# Altium schematic sheet Sheet2.SchDoc
size A3; SheetNumber: 2; SheetTotal: 3
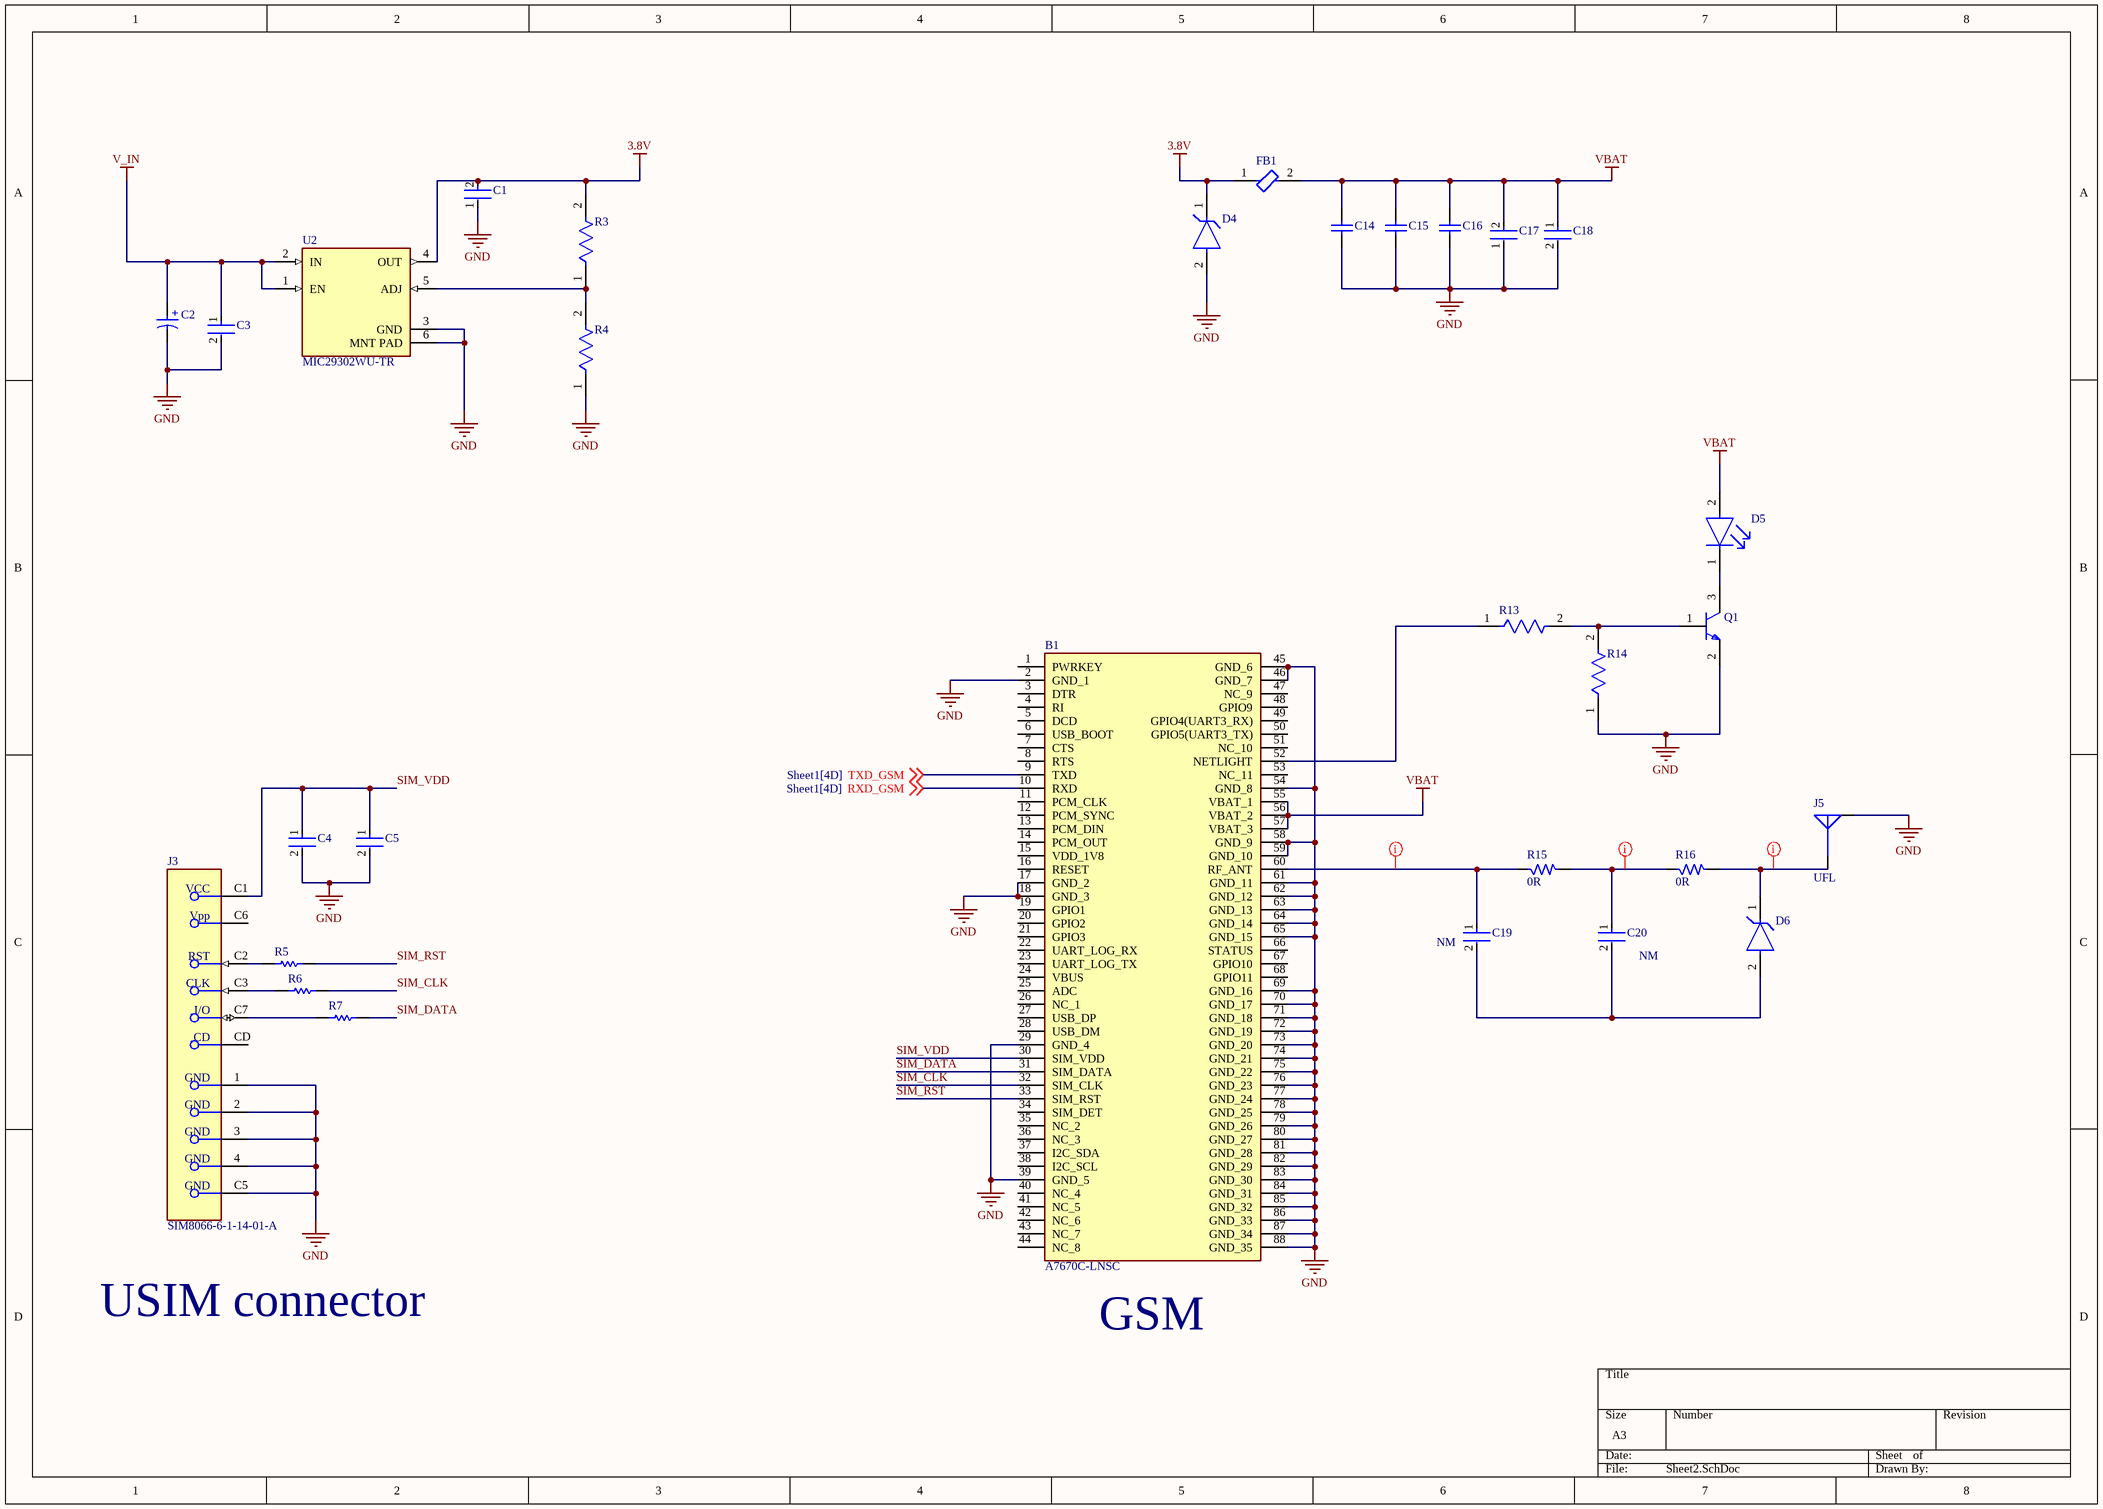
[diagram p0: Sheet2.SchDoc]

## Parts
B1  A7670C-LNSC  [A7670CLNSC]
C1  GRM155R71C104KA88D  [FP-GRM15-MFG]  (value not drawn)
C2  865060653010  [WCAP-ASLL_D8H10.5]  (value not drawn)
C3  C0402C105K8PACTU  [FP-C0402C105K8PACTU-MFG]  (value not drawn)
C4  C0402C104K4RACTU  [FP-C0402-BB-MFG]  (value not drawn)
C5  04025A330JAT2A  [FP-0402-L_1_0_1-W_0_5_0_1-IPC_A]  (value not drawn)
C14  GRM31CR60J107ME39L  [CAPC3216X190X55ML30T25]  (value not drawn)
C15  GRM31CR60J107ME39L  [CAPC3216X190X55ML30T25]  (value not drawn)
C16  GRM21BR71H105KA12L  [CAPC2013X135X45LL10T25]  (value not drawn)
C17  GRM155R71C104KA88D  [FP-GRM15-MFG]  (value not drawn)
C18  CC0603JRNPO9BN330  [FP-CC0603-0_9-IPC_C]  (value not drawn)
C19  04025C222KAT2A  [FP-0402-L_1_0_1-W_0_5_0_1-MFG]  (value not drawn)
C20  C0402C104K4RACTU  [FP-C0402-BB-MFG]  (value not drawn)
D4  SMAJ6.0A  [FP-SMAJ-MFG]  (value not drawn)
D5  LTST-C190GKT  [FP-LTST-C190GKT-MFG]  (value not drawn)
D6  SMAJ6.0A  [FP-SMAJ-MFG]  (value not drawn)
FB1  BLM21PG300SN1D  [FP-BLM21-0_2-t0_85-e0_5-d-MFG]  (value not drawn)
J3  SIM8066-6-1-14-01-A  [FP-SIM8066-6-1-14-01-A-MFG]
J5  UFL  [MOLEX SD-734120110]
Q1  BC846B,215  [FP-SOT23-IPC_B]  (value not drawn)
R3  CRCW0402100KFKED  [FP-CRCW0402-e3-IPC_C]  (value not drawn)
R4  CRCW060347K0FKEA  [FP-CRCW0603-e3-IPC_B]  (value not drawn)
R5  CRCW040222R0FKED  [RESC1005X40X25LL05T05]  (value not drawn)
R6  CRCW040222R0FKED  [RESC1005X40X25LL05T05]  (value not drawn)
R7  CRCW040222R0FKED  [RESC1005X40X25LL05T05]  (value not drawn)
R13  CRCW06034K70FKEA  [FP-CRCW0603-e3-IPC_A]  (value not drawn)
R14  CRCW060347K0FKEA  [FP-CRCW0603-e3-IPC_B]  (value not drawn)
R15  0R  [RES_0805]
R16  0R  [RES_0805]
U2  MIC29302WU-TR  [FP-C04-012-MFG]

## Nets
3.8V: C1.2 D4.1(C) FB1.1 R3.2 U2.4(OUT)
GND: B1.2(GND_1) B1.17(GND_2) B1.18(GND_3) B1.29(GND_4) B1.39(GND_5) B1.45(GND_6) B1.46(GND_7) B1.54(GND_8) B1.58(GND_9) B1.59(GND_10) B1.61(GND_11) B1.62(GND_12) B1.63(GND_13) B1.64(GND_14) B1.65(GND_15) B1.69(GND_16) B1.70(GND_17) B1.71(GND_18) B1.72(GND_19) B1.73(GND_20) B1.74(GND_21) B1.75(GND_22) B1.76(GND_23) B1.77(GND_24) B1.78(GND_25) B1.79(GND_26) B1.80(GND_27) B1.81(GND_28) B1.82(GND_29) B1.83(GND_30) B1.84(GND_31) B1.85(GND_32) B1.86(GND_33) B1.87(GND_34) B1.88(GND_35) C1.1 C2.2(N) C3.2 C4.2 C5.2 C14.1 C15.1 C16.1 C17.1 C18.2 D4.2(A) J3.1(GND) J3.2(GND) J3.3(GND) J3.4(GND) J3.C5(GND) J5.G Q1.2(E) R4.1 R14.1 U2.3(GND) U2.6(MNT_PAD)
V_IN: C2.1(P) C3.1 U2.1(EN) U2.2(IN)
VBAT: B1.55(VBAT_1) B1.56(VBAT_2) B1.57(VBAT_3) C14.2 C15.2 C16.2 C17.2 C18.1 D5.2(A) FB1.2
RXD_GSM: B1.10(RXD) ; off-sheet RXD_GSM
SIM_CLK: B1.32(SIM_CLK) R6.2
SIM_DATA: B1.31(SIM_DATA) R7.2
SIM_RST: B1.33(SIM_RST) R5.2
SIM_VDD: B1.30(SIM_VDD) C4.1 C5.1 J3.C1(VCC)
TXD_GSM: B1.9(TXD) ; off-sheet TXD_GSM
NetB1_52: B1.52(NETLIGHT) R13.1
NetB1_60: B1.60(RF_ANT) C19.1 R15.1
NetC19_2: C19.2 C20.2 D6.2(A)
NetC20_1: C20.1 R15.2 R16.1
NetD5_1: D5.1(C) Q1.3(C)
NetD6_1: D6.1(C) J5.S R16.2
NetJ3_C2: J3.C2(RST) R5.1
NetJ3_C3: J3.C3(CLK) R6.1
NetJ3_C7: J3.C7(I/O) R7.1
NetQ1_1: Q1.1(B) R13.2 R14.2
NetR3_1: R3.1 R4.2 U2.5(ADJ)

Not connected (* = marked no-connect by the designer): B1 1(PWRKEY) 3(DTR) 4(RI) 5(DCD) 6(USB_BOOT) 7(CTS) 8(RTS) 11(PCM_CLK) 12(PCM_SYNC) 13(PCM_DIN) 14(PCM_OUT) 15(VDD_1V8) 16(RESET) 19(GPIO1) 20(GPIO2) 21(GPIO3) 22(UART_LOG_RX) 23(UART_LOG_TX) 24(VBUS) 25(ADC) 26(NC_1) 27(USB_DP) 28(USB_DM) 34(SIM_DET) 35(NC_2) 36(NC_3) 37(I2C_SDA) 38(I2C_SCL) 40(NC_4) 41(NC_5) 42(NC_6) 43(NC_7) 44(NC_8) 47(NC_9) 48(GPIO9) 49(GPIO4(UART3_RX)) 50(GPIO5(UART3_TX)) 51(NC_10) 53(NC_11) 66(STATUS) 67(GPIO10) 68(GPIO11); J3 C6(Vpp) CD

## Layout directives
net class 50ohm_gsm; rule Width Constraint [Pref Impedance = 50.00ohms    Min Impedance = 50.00ohms    Max Impedance = 50.00ohms]: NetB1_60, NetC20_1, NetD6_1

## Notes on the sheet
- (near C19) NM
- (near C20) NM
- USIM connector
- (near B1) GSM
- (in symbol CMP-03913-54202488-2) +

## Library data of the parts
B1 = A7670C-LNSC: MODULE LTE CAT1; Manufacturer_Name: SIMCOM; Geometry.Height: 2.77mm; Manufacturer_Part_Number: A7670C-LNSC; Mouser Part Number: *; Mouser Price/Stock: *; Arrow Part Number: *; Arrow Price/Stock: *; Datasheet Link: https://nostris.ee/pdf/A7670%20Series%20Hardware%20Design_V1.00.pdf
C1 C17 = CMP-2100-03641-2: CAP CER 0.1UF 16V X7R 0402; Manufacturer: Murata; Standoff Height: 0mm; Tolerance: 10%; Voltage Rating: 16Vdc; Material: Ceramic; Capacitance: 0.10μF; Value: 0.10μF; RoHS: TRUE; Manufacturer Part Number: GRM155R71C104KA88D; Temperature Characteristic: X7R; Octopart: https://octopart.com/grm155r71c104ka88d-murata-196880; Digikey Description: CAP CER 0.1UF 16V X7R 0402; Device Class L3: Ceramic Capacitors; Height: 0.55mm; ComponentLink2Description: Datasheet; Temperature Range Low: -55°C; Ipc Land Pattern Name: CAPC10050X219; ComponentLink2URL: https://search.murata.co.jp/Ceramy/image/img/A01X/G101/ENG/GRM155R71H471KA01-01A.pdf; Device Class L1: Passive Components; Lead Free: yes; Category: Cap; Package: GRM15; Temperature: -55°C to +125°C; Device Class L2: Capacitors; Temperature Range High: +125°C; Mouser Description: 0402 0.1 uF 16V ±10 % Tolerance X7R SMT Multilayer Ceramic Capacitor
C2 = CMP-03913-54202488-2: 865060653010 Aluminum Electrolytic Capacitor, Polarized, Aluminum (wet), 50V, 20% +Tol, 20% -Tol, 100uF, Surface Mount, 3333; Ripple Current (AC): 350mA; ESR (Equivalent Series Resistance): 227.529mΩ; Polarity: Polar; Leakage Current: 50µA; Life (Hours): 5000hours; Capacitance: 100µF; Impedance: 340mΩ; Insulation Resistance: 1MΩ; Voltage Rating (DC): 50V; NexarPartId: 54202488; Min Operating Temperature: -55°C; Case/Package: Radial; Height - Seated (Max): 10.4902mm; Ripple Current: 350mA; Diameter: 8mm; Height: 10.5mm; Voltage Rating: 50V; Max Operating Temperature: 105°C; REACH SVHC: Unknown; Tolerance: 20%; Mount: Surface Mount; RoHS: Compliant; Length: 10.5mm
C3 = CMP-2008-02081-2: CAP CER 1UF 10V X5R 0402; Dielectric Material: Ceramic; Dissipation Factor: 5%; Tolerance: 10%; Number of Pins: 2; Contact Plating: Tin; Min Operating Temperature: -55°C; Termination: SMD/SMT; Lead Free: Lead Free; Construction: Flat; Voltage Rating (DC): 10V; Mount: Surface Mount; Series: C; Thickness: 0.022inch; Width: 0.5mm; Radiation Hardening: No; Capacitance: 1uF; Dielectric: X5R; Height: 0.5mm; Voltage: 10V; Length: 1mm; Depth: 0.5mm; Max Operating Temperature: 85°C; Package Quantity: 1; Packaging: Tape and Reel; RoHS Compliant: Yes; Case Code (Imperial): 0402; Case Code (Metric): 1005; REACH SVHC: No SVHC; Voltage Rating: 10V; Case/Package: 0402
C4 C20 = CMP-2008-02108-2: CAP CER 0.1UF 16V X7R 0402; Manufacturer: Kemet; Value: 0.10 μF; Tolerance: 0.1; Material: Ceramic; Temperature Coefficient: 15%; Voltage Rating: 16 V; Package: C0402-BB; Automotive: No; Ipc Land Pattern Name: CAPC10050X50; Device Class L3: Ceramic Capacitors; Capacitance: 0.10 μF; Octopart: https://octopart.com/c0402c104k4ractu-kemet-94158; Temperature Characteristic: X7R; Mouser Description: Cap Ceramic 0.1uF 16V X7R 10% SMD 0402 125?C Paper T/R - Tape and Reel (Alt: C0402C104K4RAC TU); ComponentLink2Description: Datasheet; Temperature Range Low: -55°C; RoHS: TRUE; Device Class L1: Passive Components; Manufacturer Part Number: C0402C104K4RACTU; Temperature Range High: +125°C; Device Class L2: Capacitors; ComponentLink2URL: https://content.kemet.com/datasheets/KEM_C1002_X7R_SMD.pdf; Category: Cap; Height: 0.55mm; Temperature: -55°C to +125°C; Lead Free: Yes; Digikey Description: CAP CER 0.1UF 16V X7R 0402
C5 = CMP-2008-02637-2: General Purpose Ceramic Capacitor, 0402, 33pF, 5%, C0G, 30ppm/°C, 50V; Insulation Resistance: 100GR; REACH SVHC: No SVHC; Radiation Hardening: No; Voltage Rating (DC): 50V; Tolerance: 5%; Voltage Rating: 50V; Mount: Surface Mount; Packaging: Tape and Reel; Construction: Flat; Voltage: 50V; Case/Package: 0402; Temperature Coefficient: 30ppm/°C; Lead Free: Lead Free; Case Code (Metric): 1005; Number of Pins: 2; Min Operating Temperature: -55°C; Capacitance: 33pF; Width: 0.5mm; Dielectric: C0G; Height: 0.5mm; Thickness: 0.022inch; Contact Plating: Tin; Length: 1mm; Package Quantity: 1; Depth: 0.5mm; Termination: SMD/SMT; Max Operating Temperature: 125°C; RoHS Compliant: Yes; Case Code (Imperial): 0402; Series: -
C14 C15 = CMP-1662-00011-2: Chip Capacitor, 100 uF, +/- 20%, 6.3 V, -55 to 85 degC, 1206 (3216 Metric), RoHS, Tape and Reel; Case\/Package: 1206; Capacitance: 100 uF; Voltage Rating (DC): 6.3 V; Type (Capacitors): X5R; REACH SVHC: No SVHC; Height: 1.6 mm; Tolerance: 20%; Packaging: Tape and Reel; Mount: Surface Mount; PackageDescription: 2-Pin Surface Mount Device, Body 3.2 x 1.6 mm; ComponentLink1URL: http://www.murata.com/; Pins: 2; ComponentLink2Description: Datasheet; PackageReference: 1206; Width: 1.6 mm; Package Quantity: 2000; Min Operating Temperature: -55 degC; Case Code (Imperial): 1206; Max Operating Temperature: 85 degC; DatasheetVersion: 09/2016; Mounting Technology: Surface Mount; Voltage Rating: 6.3 V; ComponentLink1Description: Manufacturer URL; Radiation Hardening: No; Case Code (Metric): 3216; PartNumber: GRM31CR60J107ME39L; Length: 3.2 mm; ComponentLink2URL: http://psearch.en.murata.com/capacitor/product/GRM31CR60J107ME39%23.pdf; RoHSCompliant: true
C16 = CMP-1036-04761-2: Manufacturer: Murata; Part Number: GRM21BR71H105KA12L
C18 = CMP-2000-06072-2: CAP CER 33PF 50V C0G/NPO 0603; Tolerance: 5%; Temperature Coefficient: 30ppm/°C; Dielectric: C0G; Insulation Resistance: 100GR; Dielectric Material: Ceramic; Voltage Rating (DC): 50V; Capacitance: 33pF; Voltage: 50V; Resistor Type: Ceramic; Lead Free: Lead Free; Mount: Surface Mount; Case Code (Imperial): 0603; Min Operating Temperature: -55°C; Package Quantity: 1; Case Code (Metric): 1608; Radiation Hardening: No; Packaging: Tape and Reel; Length: 1.6mm; Width: 0.031inch; Termination: SMD/SMT; Max Operating Temperature: 125°C; Series: CC; Case/Package: 0603; RoHS Compliant: Yes; Number of Pins: 2; REACH SVHC: No SVHC; Thickness: 0.035inch; Depth: 0.8mm; Voltage Rating: 50V; Height: 0.8mm
C19 = CMP-2008-02711-2: General Purpose Ceramic Capacitor, 0402, 2.2nF, 10%, X7R, 15%, 50V; Voltage: 50V; Case/Package: 0402; Length: 1mm; Mount: Surface Mount; Series: -; Dielectric Material: Ceramic; Termination: SMD/SMT; Dielectric: X7R; Width: 0.02inch; Tolerance: 10%; Contact Plating: Tin; Radiation Hardening: No; Case Code (Imperial): 0402; Packaging: Tape and Reel; Number of Pins: 2; Case Code (Metric): 1005; Lead Free: Lead Free; Thickness: 0.022inch; Height: 0.56mm; Voltage Rating: 50V; RoHS Compliant: Yes; Capacitance: 2.2nF; Depth: 0.5mm; Voltage Rating (DC): 50V; Max Operating Temperature: 125°C; Construction: Flat; Min Operating Temperature: -55°C; Package Quantity: 1; REACH SVHC: No SVHC
D4 D6 = CMP-08607-000083-1: TVS DIODE 6V 10.3V DO214AC; Manufacturer: Littelfuse; Breakdown Voltage: 6.67V; Number Of Channels: 1; Direction: Unidirectional; Max Junction Temp: +150°C; Peak Pulse Current: 38.8A; Peak Pulse Power: 400W; Device Class L1: Circuit Protection; Device Class L3: unset; ComponentLink2URL: https://www.littelfuse.com/~/media/electronics/datasheets/tvs_diodes/littelfuse_tvs_diode_smaj_datasheet.pdf.pdf; Lead Free: Yes; Digikey Description: TVS DIODE 6V 10.3V DO214AC; Height: 2.29mm; Reverse Standoff Voltage: 6V; Package: SMAJ; Manufacturer Part Number: SMAJ6.0A; Octopart: https://octopart.com/smaj6.0a-littelfuse-350212; Category: Diode; Automotive: No; Clamping Voltage: 10.3V; RoHS: TRUE; ComponentLink2Description: Datasheet; Temperature Range Low: -65°C; Temperature: -65°C to +150°C; Temperature Range High: +150°C; Device Class L2: TVS Diodes; Mouser Description: TVS Diodes - Transient Voltage Suppressors 60Vr 400W 4.1A 5% UniDirectional
D5 = CMP-22017-000005-2: LED GREEN CLEAR CHIP SMD; Dominant Wavelength: 569nm; Reverse Voltage: 5V; Lens Color: Colorless; Viewing Angle: 130°; Voltage: 2V; Forward Current: 30mA; Power Dissipation: 100mW; Luminous Intensity: 6mcd; Number of LEDs: 1; Forward Voltage: 2.1V; Wavelength: 565nm; Test Current: 10mA; Min Operating Temperature: -55°C; Lens Style: Clear; Mount: Surface Mount; Width: 0.8mm; Packaging: Tape and Reel; Lens Transparency: Clear; Case Code (Metric): 1608; Depth: 0.8mm; Case Code (Imperial): 0603; Case/Package: 0603; Number of Pins: 2; Max Operating Temperature: 85°C; Lead Free: Lead Free; Number of Elements: 1; Length: 1.6mm; Height: 0.8mm; Package Quantity: 1; Power Rating: 100mW; Radiation Hardening: No; Illumination Color: Green; Color: Green
FB1 = CMP-0686-00620-3: Chip Ferrite Bead, 0805, 30Ω @ 100MHz, 0.014Ω, , 4A; Tolerance: 25%; Number of Circuits: 1; Impedance: 30R; Max DC Current: 3A; Shielding: Unshielded; Material: Steel; Resistance: 15mR; DC Resistance-Max: 14mR; Series: BLM21P; Military Standard: Not; Max Current Rating: 4A; Termination: SMD/SMT; Length: 2mm; Width: 1.25mm; Test Frequency: 100MHz; Packaging: Tape and Reel; Case/Package: 0805; Current Rating: 4A; Depth: 1.25mm; Package Quantity: 1; REACH SVHC: No SVHC; Core Material: Ferrite; Max Operating Temperature: 125°C; DC Current: 3A; Height: 0.85mm; Frequency: 100MHz; Number of Lines: 1; Case Code (Metric): 2012; Min Operating Temperature: -55°C; Radiation Hardening: No; Case Code (Imperial): 0805; Number of Pins: 2; RoHS Compliant: Yes; DC Resistance (DCR): 14mR; Lead Free: Lead Free
J3 = CMP-03329-117635865-1: SIM8066-6-1-14-01-A Memory Card Connectors 1.44mm Nano SIM Conn w/Peg and Switch; Current Rating: 1A; Number of Contacts: 6; Voltage Rating: 30V; NexarPartId: 117635865; Number of Pins: 6; Min Operating Temperature: -40°C; Max Operating Temperature: 85°C; Contact Material: Gold, Nickel
J5 = UFL MOLEX SD-734120110: PartNumber: MOLEX SD-734120110
Q1 = CMP-14406-000027-1: TRANS NPN 65V 0.1A SOT23; RoHS Compliant: Yes
R3 = CMP-2002-08123-3: RES Thick Film, 100kΩ, 1%, 0.063W, 100ppm/°C, 0402; Power Rating: 63mW; Resistance: 100kR; Voltage Rating (DC): 50V; Lead Free: Lead Free; Height: 0.35mm; Contact Plating: Tin; Min Operating Temperature: -55°C; Package Quantity: 10000; Case/Package: 0402; Temperature Coefficient: 100ppm/°C; Number of Terminations: 2; Packaging: Tape and Reel; Max Power Dissipation: 63mW; Case Code (Metric): 1005; Mount: Surface Mount; Width: 0.02inch; Termination: SMD/SMT; Length: 1mm; Number of Pins: 2; Weight: 2.3E-05oz; Radiation Hardening: No; Tolerance: 1%; Military Standard: Not; Features: Automotive AEC-Q200; Depth: 0.5mm; Composition: Thick Film; Max Operating Temperature: 155°C; Voltage Rating: 50V; Case Code (Imperial): 0402
R4 R14 = CMP-2000-03379-3: RES SMD 47K OHM 1% 1/10W 0603; Voltage Rating: 75V; Max Power Dissipation: 100mW; Resistance: 47kR; Temperature Coefficient: 100ppm/°C; Size Code: 0603; Technology: THICK FILM; Case Code (Metric): 1608; Radiation Hardening: No; Case/Package: 0603; Number of Terminations: 2; Package Quantity: 5000; Width: 0.85mm; Series: CRCW; RoHS Compliant: Yes; Case Code (Imperial): 0603; Lead Free: Lead Free; Resistance Tolerance: 1%; Depth: 0.85mm; Contact Plating: Tin; Tolerance: 1%; Voltage Rating (DC): 75V; Min Operating Temperature: -55°C; Mount: Surface Mount; Packaging: Tape and Reel; Length: 1.55mm; Resistor Type: Thick Film; Features: Automotive AEC-Q200; Max Operating Temperature: 155°C; Weight: 7.1E-05oz; Construction: Rectangular; Height: 0.45mm; Military Standard: Not; Termination: SMD/SMT; Power Rating: 100mW
R5-R7 = CMP-2002-08382-1: Manufacturer: Vishay Dale; Part Number: CRCW040222R0FKED
R13 = CMP-1666-00019-3: RES Thick Film, 4.7kΩ, 1%, 0.1W, 100ppm/°C, 0603; Resistance: 4.7kR; Voltage Rating: 75V; Power Rating: 100mW; Case Code (Metric): 1608; Military Standard: Not; Packaging: Tape and Reel; Termination: SMD/SMT; Temperature Coefficient: 100ppm/°C; Lead Free: Lead Free; Length: 1.55mm; Width: 0.85mm; Height: 0.45mm; Depth: 0.85mm; Weight: 7.1E-05oz; Case Code (Imperial): 0603; Contact Plating: Tin; Case/Package: 0603; Max Operating Temperature: 155°C; Mount: Surface Mount; Tolerance: 1%; Min Operating Temperature: -55°C; Package Quantity: 5000; Voltage Rating (DC): 75V; Composition: Thick Film
R15 R16 = RES_0R-0.125W-1%-0805: 0 Ohms Jumper 0.125W, 1/8W Chip Resistor 0805 (2012 Metric) Automotive AEC-Q200 Thick Film; Manufacturer: Walsin; Manufacturer Part Number: WR08X000PTL; Case/Package: 0805; Supplier-1: SIRICOM; Supplier Part Number-1: WR08X000PTL; Alternate Part Number-1: WR08X000PTL
U2 = CMP-06324-000007-1: IC REG LINEAR POS ADJ 3A TO263-5; Manufacturer: Microchip; Output Voltage: 3.3-12V; Output Type: AdjustableProgrammable; Max Junction Temp: +125°C; Standoff Height: 0mm; Accuracy Percentage: 1%; Max Supply Voltage: 26V; Nominal Supply Current: 10-37mA; Number Of Outputs: 1; Dropout Voltage: 370mV; Min Supply Voltage: 2.25V; ComponentLink2URL: http://ww1.microchip.com/downloads/en/DeviceDoc/MIC2915x-30x-50x-75x-High-Current-Low-Dropout-Regulators-DS20005685B.pdf; Device Class L1: Integrated Circuits (ICs); Digikey Description: IC REG LINEAR POS ADJ 3A TO263-5; Device Class L2: Power Management ICs; Lead Free: Yes; Mouser Description: LDO Voltage Regulators; Package: C04-012; Temperature: -40°C to +125°C; ComponentLink2Description: Datasheet; Temperature Range High: +125°C; Automotive: No; Device Class L3: Voltage Regulators - Linear; Category: IC; Temperature Range Low: -40°C; RoHS: TRUE; Output Current: 3A; Octopart: https://octopart.com/mic29302wu-tr-microchip-66801318; Manufacturer Part Number: MIC29302WU-TR; Height: 0.2inch